# Altium schematic sheet Sheet2.SchDoc
size A4; SheetNumber: 1; SheetTotal: 1
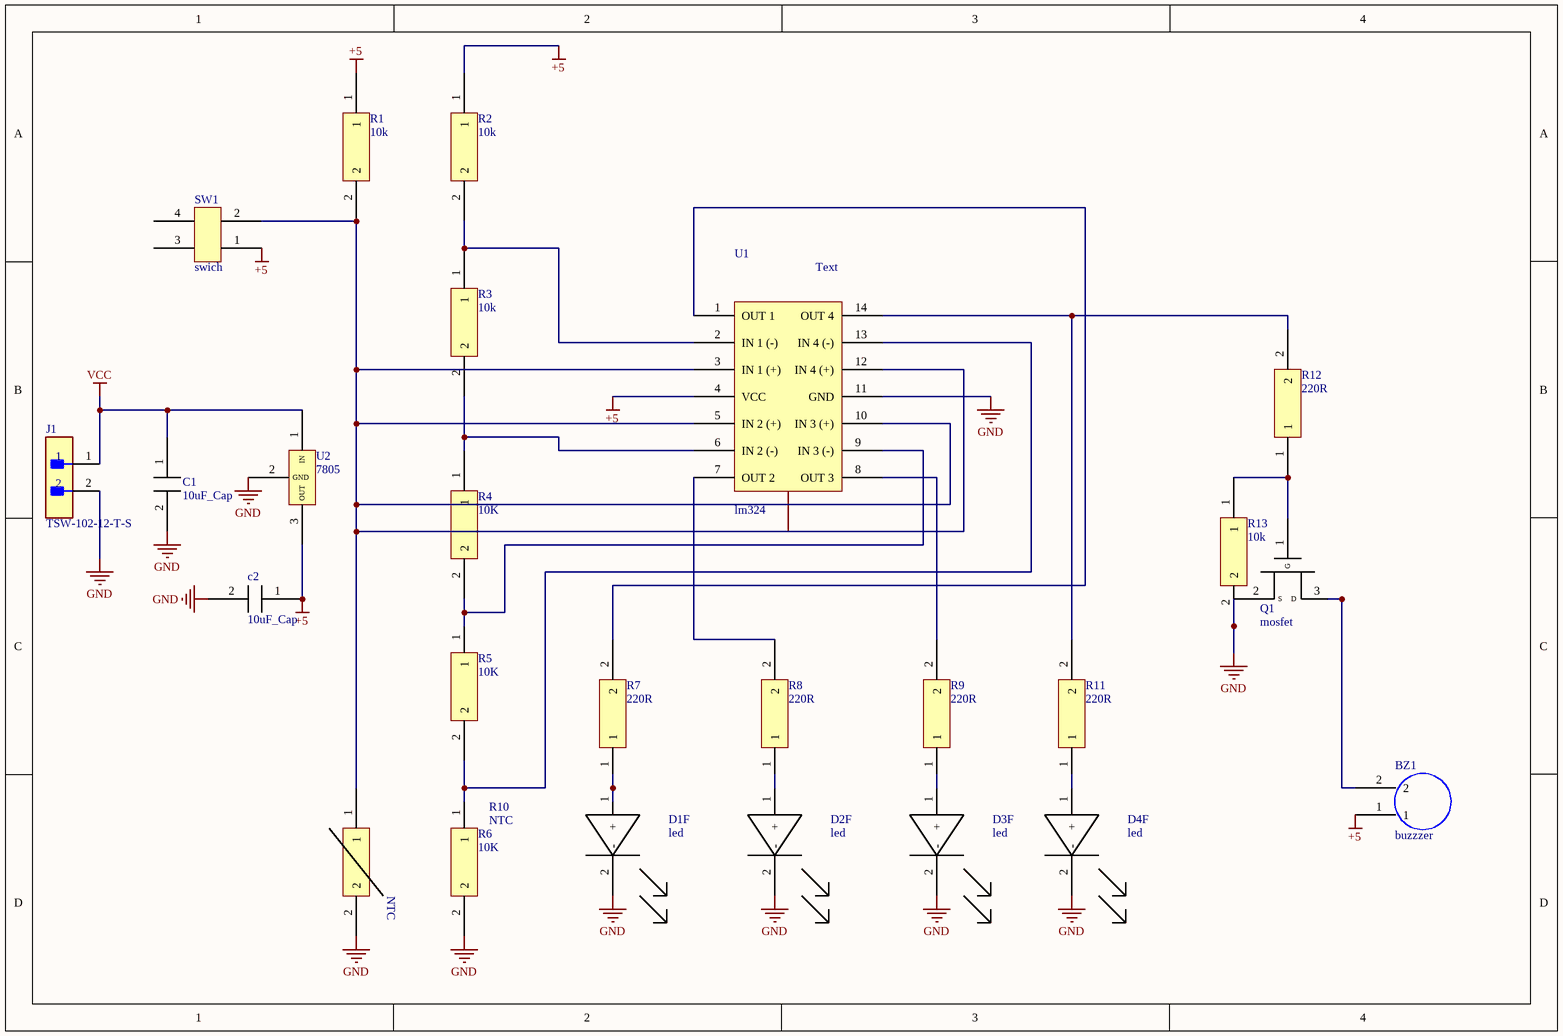
[diagram p0: Sheet2.SchDoc]

## Parts
BZ1  buzzzer  [PCBComponent_1]
C1  10uF_Cap  [CAPCP2012X14N]
c2  10uF_Cap  [DIOC2012X06N]
D1  led  [DIOC2012X06]  (part F of 6)
D2  led  [DIOC2012X06N]  (part F of 6)
D3  led  [DIOC2012X06N]  (part F of 6)
D4  led  [DIOC2012X06N]  (part F of 6)
J1  TSW-102-12-T-S  [FP-TSW-102-12-T-S-MFG]
Q1  mosfet  [SOT95P245X110-3N]
R1  10k  [CAPCP2012X14N]
R2  10k  [CAPCP2012X14N]
R3  10k  [CAPCP2012X14N]
R4  10K  [CAPCP2012X14N]
R5  10K  [CAPCP2012X14N]
R6  10K  [CAPCP2012X14N]
R7  220R  [CAPCP2012X14N]
R8  220R  [CAPCP2012X14N]
R9  220R  [CAPCP2012X14N]
R10  NTC  [NTC]
R11  220R  [CAPCP2012X14N]
R12  220R  [RESC2012X06N]
R13  10k  [RESC2012X06N]
SW1  swich  [PCBComponent_1 - duplicate4]
U1  lm324  [SOIC127P600X175-14N]
U2  7805  [DPAK228P990X238-3N]

## Nets
+5: BZ1.1 c2.1 R1.1 R2.1 SW1.1 U1.4(VCC) U2.3(OUT)
GND: C1.2 c2.2 D1.2(-) D2.2(-) D3.2(-) D4.2(-) J1.2 Q1.2(S) R6.2 R10.2 R13.2 U1.11(GND) U2.2(GND)
VCC: C1.1 J1.1 U2.1(IN)
NetBZ1_2: BZ1.2 Q1.3(D)
NetD1_1: D1.1(+) R7.1
NetD2_1: D2.1(+) R8.1
NetD3_1: D3.1(+) R9.1
NetD4_1: D4.1(+) R11.1
NetQ1_1: Q1.1(G) R12.1 R13.1
NetR1_2: R1.2 R10.1 SW1.2 U1.3(IN_1_(+)) U1.5(IN_2_(+)) U1.10(IN_3_(+)) U1.12(IN_4_(+))
NetR2_2: R2.2 R3.1 U1.2(IN_1_(-))
NetR3_2: R3.2 R4.1 U1.6(IN_2_(-))
NetR4_2: R4.2 R5.1 U1.9(IN_3_(-))
NetR5_2: R5.2 R6.1 U1.13(IN_4_(-))
NetR7_2: R7.2 U1.1(OUT_1)
NetR8_2: R8.2 U1.7(OUT_2)
NetR9_2: R9.2 U1.8(OUT_3)
NetR11_2: R11.2 R12.2 U1.14(OUT_4)

Not connected (* = marked no-connect by the designer): SW1 3 4

## Notes on the sheet
- (in symbol lm324) Text

## Library data of the parts
J1 = CMP-02766-001444-1: CONN HEADER VERT 2POS 2.54MM; Gender: Male; Number of Contacts: 2; RoHS Compliant: Yes; Mount: Through Hole; Termination: Solder; Packaging: Bulk; Contact Material: Bronze; Contact Plating: Tin; Number of Rows: 1; REACH SVHC: No SVHC; Pitch: 2.54mm; Radiation Hardening: No
R1-R9 R11-R13 = RES_0805